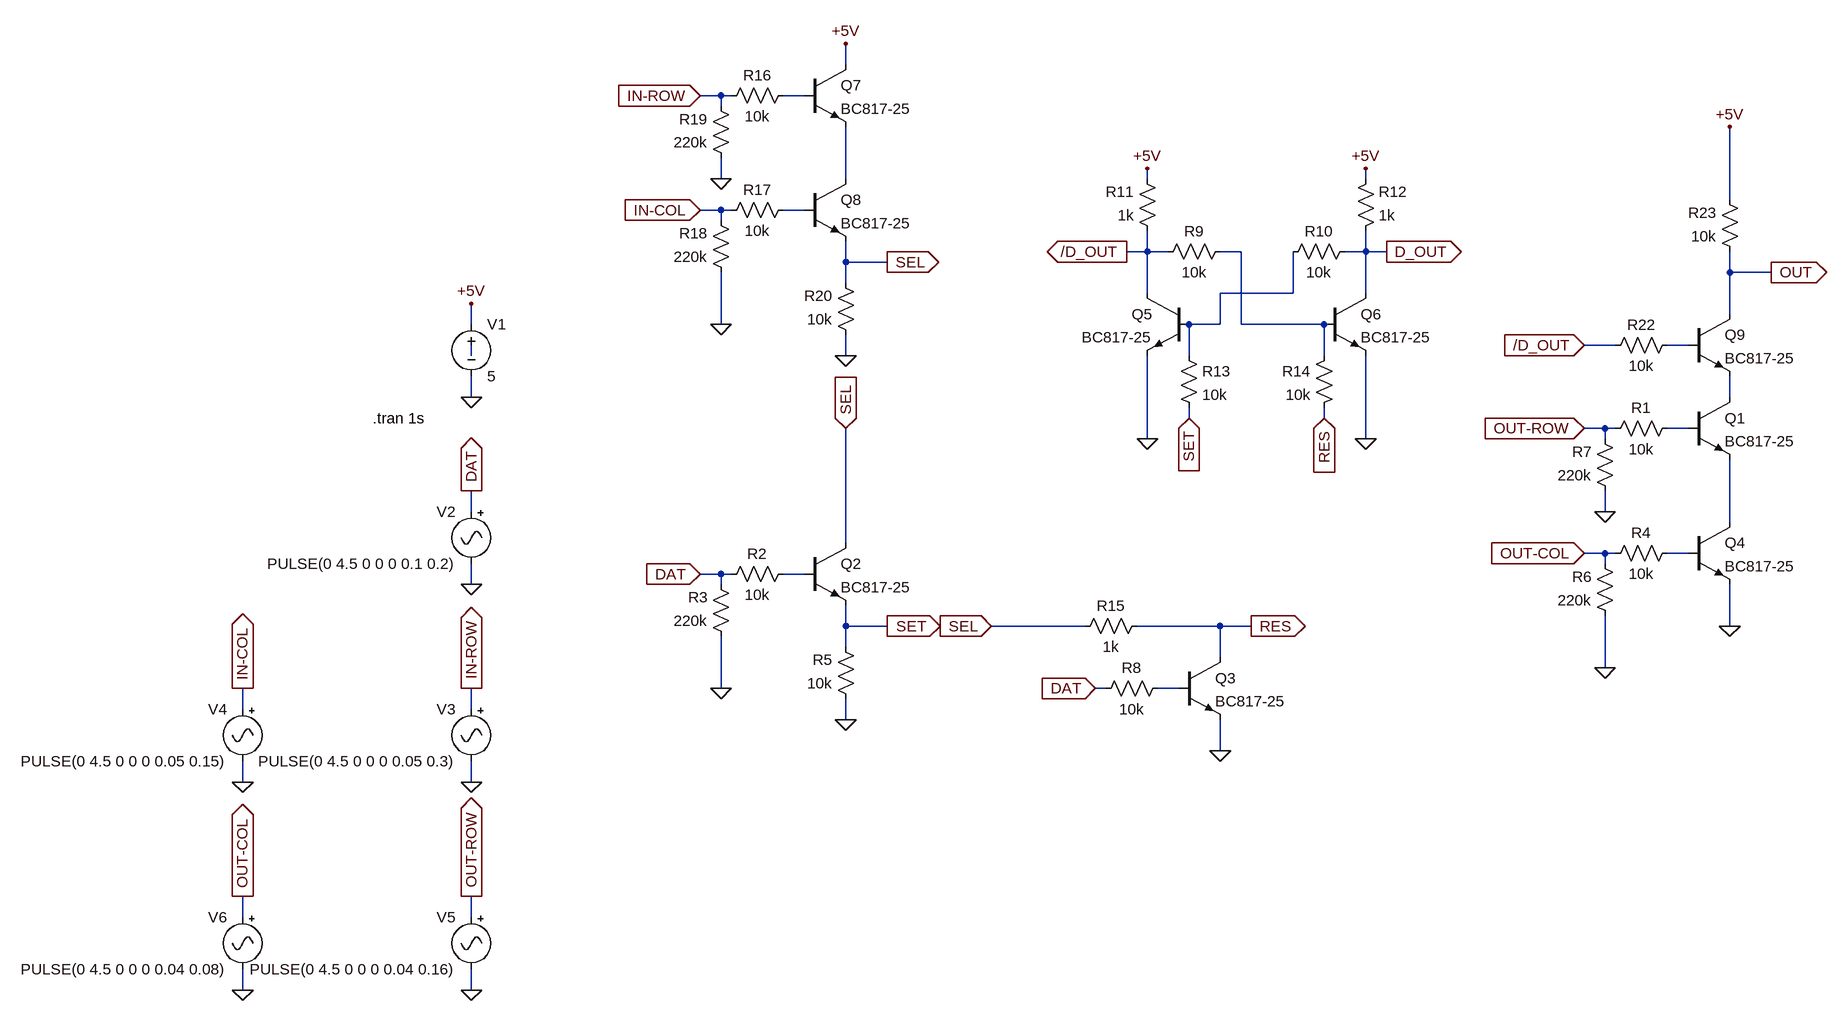
[diagram p0: schematic FlipFlop-basic.asc]
FlipFlop-basic.asc, the LTspice schematic file:
Version 4
SHEET 1 1908 1044
WIRE 192 -496 192 -528
WIRE 0 -448 -32 -448
WIRE 16 -448 0 -448
WIRE 128 -448 96 -448
WIRE 0 -432 0 -448
WIRE 0 -320 0 -352
WIRE 192 -320 192 -400
WIRE 656 -320 656 -336
WIRE 992 -320 992 -336
WIRE 1552 -288 1552 -400
WIRE 0 -272 -32 -272
WIRE 16 -272 0 -272
WIRE 128 -272 96 -272
WIRE 0 -256 0 -272
WIRE 656 -208 656 -240
WIRE 656 -208 624 -208
WIRE 688 -208 656 -208
WIRE 800 -208 768 -208
WIRE 992 -208 992 -240
WIRE 992 -208 960 -208
WIRE 1024 -208 992 -208
WIRE 192 -192 192 -224
WIRE 256 -192 192 -192
WIRE 1552 -176 1552 -208
WIRE 1616 -176 1552 -176
WIRE 192 -160 192 -192
WIRE 656 -144 656 -208
WIRE 880 -144 880 -208
WIRE 880 -144 768 -144
WIRE 992 -144 992 -208
WIRE 1552 -112 1552 -176
WIRE -384 -96 -384 -128
WIRE 0 -96 0 -176
WIRE 768 -96 768 -144
WIRE 768 -96 720 -96
WIRE 800 -96 800 -208
WIRE 928 -96 800 -96
WIRE 1376 -64 1328 -64
WIRE 1488 -64 1456 -64
WIRE -384 -48 -384 -64
WIRE 192 -48 192 -80
WIRE 720 -48 720 -96
WIRE 928 -48 928 -96
WIRE -384 16 -384 -16
WIRE 1552 16 1552 -16
WIRE 720 48 720 32
WIRE 928 48 928 32
WIRE 1360 64 1328 64
WIRE 1376 64 1360 64
WIRE 1488 64 1456 64
WIRE 656 80 656 -48
WIRE 992 80 992 -48
WIRE 1360 80 1360 64
WIRE -384 192 -384 160
WIRE 1360 192 1360 160
WIRE 1552 208 1552 112
WIRE 192 240 192 64
WIRE 1360 256 1328 256
WIRE 1376 256 1360 256
WIRE 1488 256 1456 256
WIRE 1360 272 1360 256
WIRE 0 288 -32 288
WIRE 16 288 0 288
WIRE 128 288 96 288
WIRE -384 304 -384 272
WIRE 0 304 0 288
WIRE 192 368 192 336
WIRE 256 368 192 368
WIRE 560 368 416 368
WIRE 768 368 640 368
WIRE 816 368 768 368
WIRE 1552 368 1552 304
WIRE 192 400 192 368
WIRE 768 416 768 368
WIRE 1360 432 1360 352
WIRE 0 464 0 384
WIRE 592 464 576 464
WIRE 704 464 672 464
WIRE -736 496 -736 464
WIRE -384 496 -384 464
WIRE 192 512 192 480
WIRE 768 560 768 512
WIRE -736 608 -736 576
WIRE -384 608 -384 576
WIRE -736 816 -736 784
WIRE -384 816 -384 784
WIRE -736 928 -736 896
WIRE -384 928 -384 896
FLAG 192 512 0
FLAG 0 464 0
FLAG -384 16 0
FLAG -384 304 0
FLAG -384 608 0
FLAG 416 368 SEL
IOPIN 416 368 In
FLAG 656 80 0
FLAG 992 80 0
FLAG 720 48 SET
IOPIN 720 48 In
FLAG 928 48 RES
IOPIN 928 48 In
FLAG 624 -208 /D_OUT
IOPIN 624 -208 Out
FLAG 1024 -208 D_OUT
IOPIN 1024 -208 Out
FLAG -384 -128 +5V
FLAG 192 64 SEL
IOPIN 192 64 In
FLAG 656 -336 +5V
FLAG 992 -336 +5V
FLAG -384 160 DAT
IOPIN -384 160 Out
FLAG -384 464 IN-ROW
IOPIN -384 464 Out
FLAG -32 288 DAT
IOPIN -32 288 In
FLAG 256 368 SET
IOPIN 256 368 Out
FLAG 768 560 0
FLAG 816 368 RES
IOPIN 816 368 Out
FLAG 576 464 DAT
IOPIN 576 464 In
FLAG 192 -48 0
FLAG 0 -320 0
FLAG 0 -96 0
FLAG 192 -528 +5V
FLAG -32 -448 IN-ROW
IOPIN -32 -448 In
FLAG -32 -272 IN-COL
IOPIN -32 -272 In
FLAG 256 -192 SEL
IOPIN 256 -192 Out
FLAG -736 608 0
FLAG -736 464 IN-COL
IOPIN -736 464 Out
FLAG 1552 368 0
FLAG 1360 192 0
FLAG 1360 432 0
FLAG 1552 -400 +5V
FLAG 1328 64 OUT-ROW
IOPIN 1328 64 In
FLAG 1328 256 OUT-COL
IOPIN 1328 256 In
FLAG 1328 -64 /D_OUT
IOPIN 1328 -64 In
FLAG -384 928 0
FLAG -384 784 OUT-ROW
IOPIN -384 784 Out
FLAG -736 928 0
FLAG -736 784 OUT-COL
IOPIN -736 784 Out
FLAG 1616 -176 OUT
IOPIN 1616 -176 Out
SYMBOL npn 128 240 R0
SYMATTR InstName Q2
SYMATTR Value BC817-25
SYMBOL voltage -384 -112 R0
WINDOW 123 0 0 Left 2
WINDOW 39 0 0 Left 2
SYMATTR InstName V1
SYMATTR Value 5
SYMBOL res 112 272 R90
WINDOW 0 0 56 VBottom 2
WINDOW 3 32 56 VTop 2
SYMATTR InstName R2
SYMATTR Value 10k
SYMBOL res 16 400 R180
WINDOW 0 36 76 Left 2
WINDOW 3 36 40 Left 2
SYMATTR InstName R3
SYMATTR Value 220k
SYMBOL res 208 496 R180
WINDOW 0 36 76 Left 2
WINDOW 3 36 40 Left 2
SYMATTR InstName R5
SYMATTR Value 10k
SYMBOL Misc\\signal -384 176 M0
WINDOW 123 0 0 Left 2
WINDOW 39 0 0 Left 2
SYMATTR InstName V2
SYMATTR Value PULSE(0 4.5 0 0 0 0.1 0.2)
SYMBOL Misc\\signal -384 480 M0
WINDOW 123 0 0 Left 2
WINDOW 39 0 0 Left 2
SYMATTR InstName V3
SYMATTR Value PULSE(0 4.5 0 0 0 0.05 0.3)
SYMBOL npn 704 416 R0
SYMATTR InstName Q3
SYMATTR Value BC817-25
SYMBOL res 688 448 R90
WINDOW 0 0 56 VBottom 2
WINDOW 3 32 56 VTop 2
SYMATTR InstName R8
SYMATTR Value 10k
SYMBOL npn 720 -144 M0
SYMATTR InstName Q5
SYMATTR Value BC817-25
SYMBOL npn 928 -144 R0
SYMATTR InstName Q6
SYMATTR Value BC817-25
SYMBOL res 784 -224 R90
WINDOW 0 0 56 VBottom 2
WINDOW 3 32 56 VTop 2
SYMATTR InstName R9
SYMATTR Value 10k
SYMBOL res 976 -224 R90
WINDOW 0 0 56 VBottom 2
WINDOW 3 32 56 VTop 2
SYMATTR InstName R10
SYMATTR Value 10k
SYMBOL res 672 -224 R180
WINDOW 0 36 76 Left 2
WINDOW 3 36 40 Left 2
SYMATTR InstName R11
SYMATTR Value 1k
SYMBOL res 976 -224 M180
WINDOW 0 36 76 Left 2
WINDOW 3 36 40 Left 2
SYMATTR InstName R12
SYMATTR Value 1k
SYMBOL res 704 -64 R0
SYMATTR InstName R13
SYMATTR Value 10k
SYMBOL res 944 -64 M0
SYMATTR InstName R14
SYMATTR Value 10k
SYMBOL res 656 352 R90
WINDOW 0 0 56 VBottom 2
WINDOW 3 32 56 VTop 2
SYMATTR InstName R15
SYMATTR Value 1k
SYMBOL npn 128 -496 R0
SYMATTR InstName Q7
SYMATTR Value BC817-25
SYMBOL npn 128 -320 R0
SYMATTR InstName Q8
SYMATTR Value BC817-25
SYMBOL res 112 -464 R90
WINDOW 0 0 56 VBottom 2
WINDOW 3 32 56 VTop 2
SYMATTR InstName R16
SYMATTR Value 10k
SYMBOL res 112 -288 R90
WINDOW 0 0 56 VBottom 2
WINDOW 3 32 56 VTop 2
SYMATTR InstName R17
SYMATTR Value 10k
SYMBOL res 16 -160 R180
WINDOW 0 36 76 Left 2
WINDOW 3 36 40 Left 2
SYMATTR InstName R18
SYMATTR Value 220k
SYMBOL res 16 -336 R180
WINDOW 0 36 76 Left 2
WINDOW 3 36 40 Left 2
SYMATTR InstName R19
SYMATTR Value 220k
SYMBOL res 208 -64 R180
WINDOW 0 36 76 Left 2
WINDOW 3 36 40 Left 2
SYMATTR InstName R20
SYMATTR Value 10k
SYMBOL Misc\\signal -736 480 M0
WINDOW 123 0 0 Left 2
WINDOW 39 0 0 Left 2
SYMATTR InstName V4
SYMATTR Value PULSE(0 4.5 0 0 0 0.05 0.15)
SYMBOL npn 1488 16 R0
SYMATTR InstName Q1
SYMATTR Value BC817-25
SYMBOL npn 1488 208 R0
SYMATTR InstName Q4
SYMATTR Value BC817-25
SYMBOL res 1472 48 R90
WINDOW 0 0 56 VBottom 2
WINDOW 3 32 56 VTop 2
SYMATTR InstName R1
SYMATTR Value 10k
SYMBOL res 1472 240 R90
WINDOW 0 0 56 VBottom 2
WINDOW 3 32 56 VTop 2
SYMATTR InstName R4
SYMATTR Value 10k
SYMBOL res 1376 368 R180
WINDOW 0 36 76 Left 2
WINDOW 3 36 40 Left 2
SYMATTR InstName R6
SYMATTR Value 220k
SYMBOL res 1376 176 R180
WINDOW 0 36 76 Left 2
WINDOW 3 36 40 Left 2
SYMATTR InstName R7
SYMATTR Value 220k
SYMBOL npn 1488 -112 R0
SYMATTR InstName Q9
SYMATTR Value BC817-25
SYMBOL res 1472 -80 R90
WINDOW 0 0 56 VBottom 2
WINDOW 3 32 56 VTop 2
SYMATTR InstName R22
SYMATTR Value 10k
SYMBOL Misc\\signal -384 800 M0
WINDOW 123 0 0 Left 2
WINDOW 39 0 0 Left 2
SYMATTR InstName V5
SYMATTR Value PULSE(0 4.5 0 0 0 0.04 0.16)
SYMBOL Misc\\signal -736 800 M0
WINDOW 123 0 0 Left 2
WINDOW 39 0 0 Left 2
SYMATTR InstName V6
SYMATTR Value PULSE(0 4.5 0 0 0 0.04 0.08)
SYMBOL res 1568 -192 R180
WINDOW 0 36 76 Left 2
WINDOW 3 36 40 Left 2
SYMATTR InstName R23
SYMATTR Value 10k
TEXT -536 48 Left 2 !.tran 1s

The netlist it stands for:
* FlipFlop-basic.asc
Q2 SEL N012 SET 0 BC817-25
V1 +5V 0 5
R2 N012 DAT 10k
R3 0 DAT 220k
R5 0 SET 10k
V2 DAT 0 PULSE(0 4.5 0 0 0 0.1 0.2)
V3 IN-ROW 0 PULSE(0 4.5 0 0 0 0.05 0.3)
Q3 RES N013 0 0 BC817-25
R8 N013 DAT 10k
Q5 /D_OUT N005 0 0 BC817-25
Q6 D_OUT N004 0 0 BC817-25
R9 N004 /D_OUT 10k
R10 D_OUT N005 10k
R11 /D_OUT +5V 1k
R12 D_OUT +5V 1k
R13 N005 SET 10k
R14 N004 RES 10k
R15 RES SEL 1k
Q7 +5V N001 N002 0 BC817-25
Q8 N002 N003 SEL 0 BC817-25
R16 N001 IN-ROW 10k
R17 N003 IN-COL 10k
R18 0 IN-COL 220k
R19 0 IN-ROW 220k
R20 0 SEL 10k
V4 IN-COL 0 PULSE(0 4.5 0 0 0 0.05 0.15)
Q1 N008 N009 N010 0 BC817-25
Q4 N010 N011 0 0 BC817-25
R1 N009 OUT-ROW 10k
R4 N011 OUT-COL 10k
R6 0 OUT-COL 220k
R7 0 OUT-ROW 220k
Q9 OUT N006 N008 0 BC817-25
R22 N006 /D_OUT 10k
V5 OUT-ROW 0 PULSE(0 4.5 0 0 0 0.04 0.16)
V6 OUT-COL 0 PULSE(0 4.5 0 0 0 0.04 0.08)
R23 OUT +5V 10k
.model NPN NPN
.model PNP PNP
.lib standard.bjt
.tran 1s
.backanno
.end